# EAGLE design mlx90621_breakout (EAGLE 9.0.1)
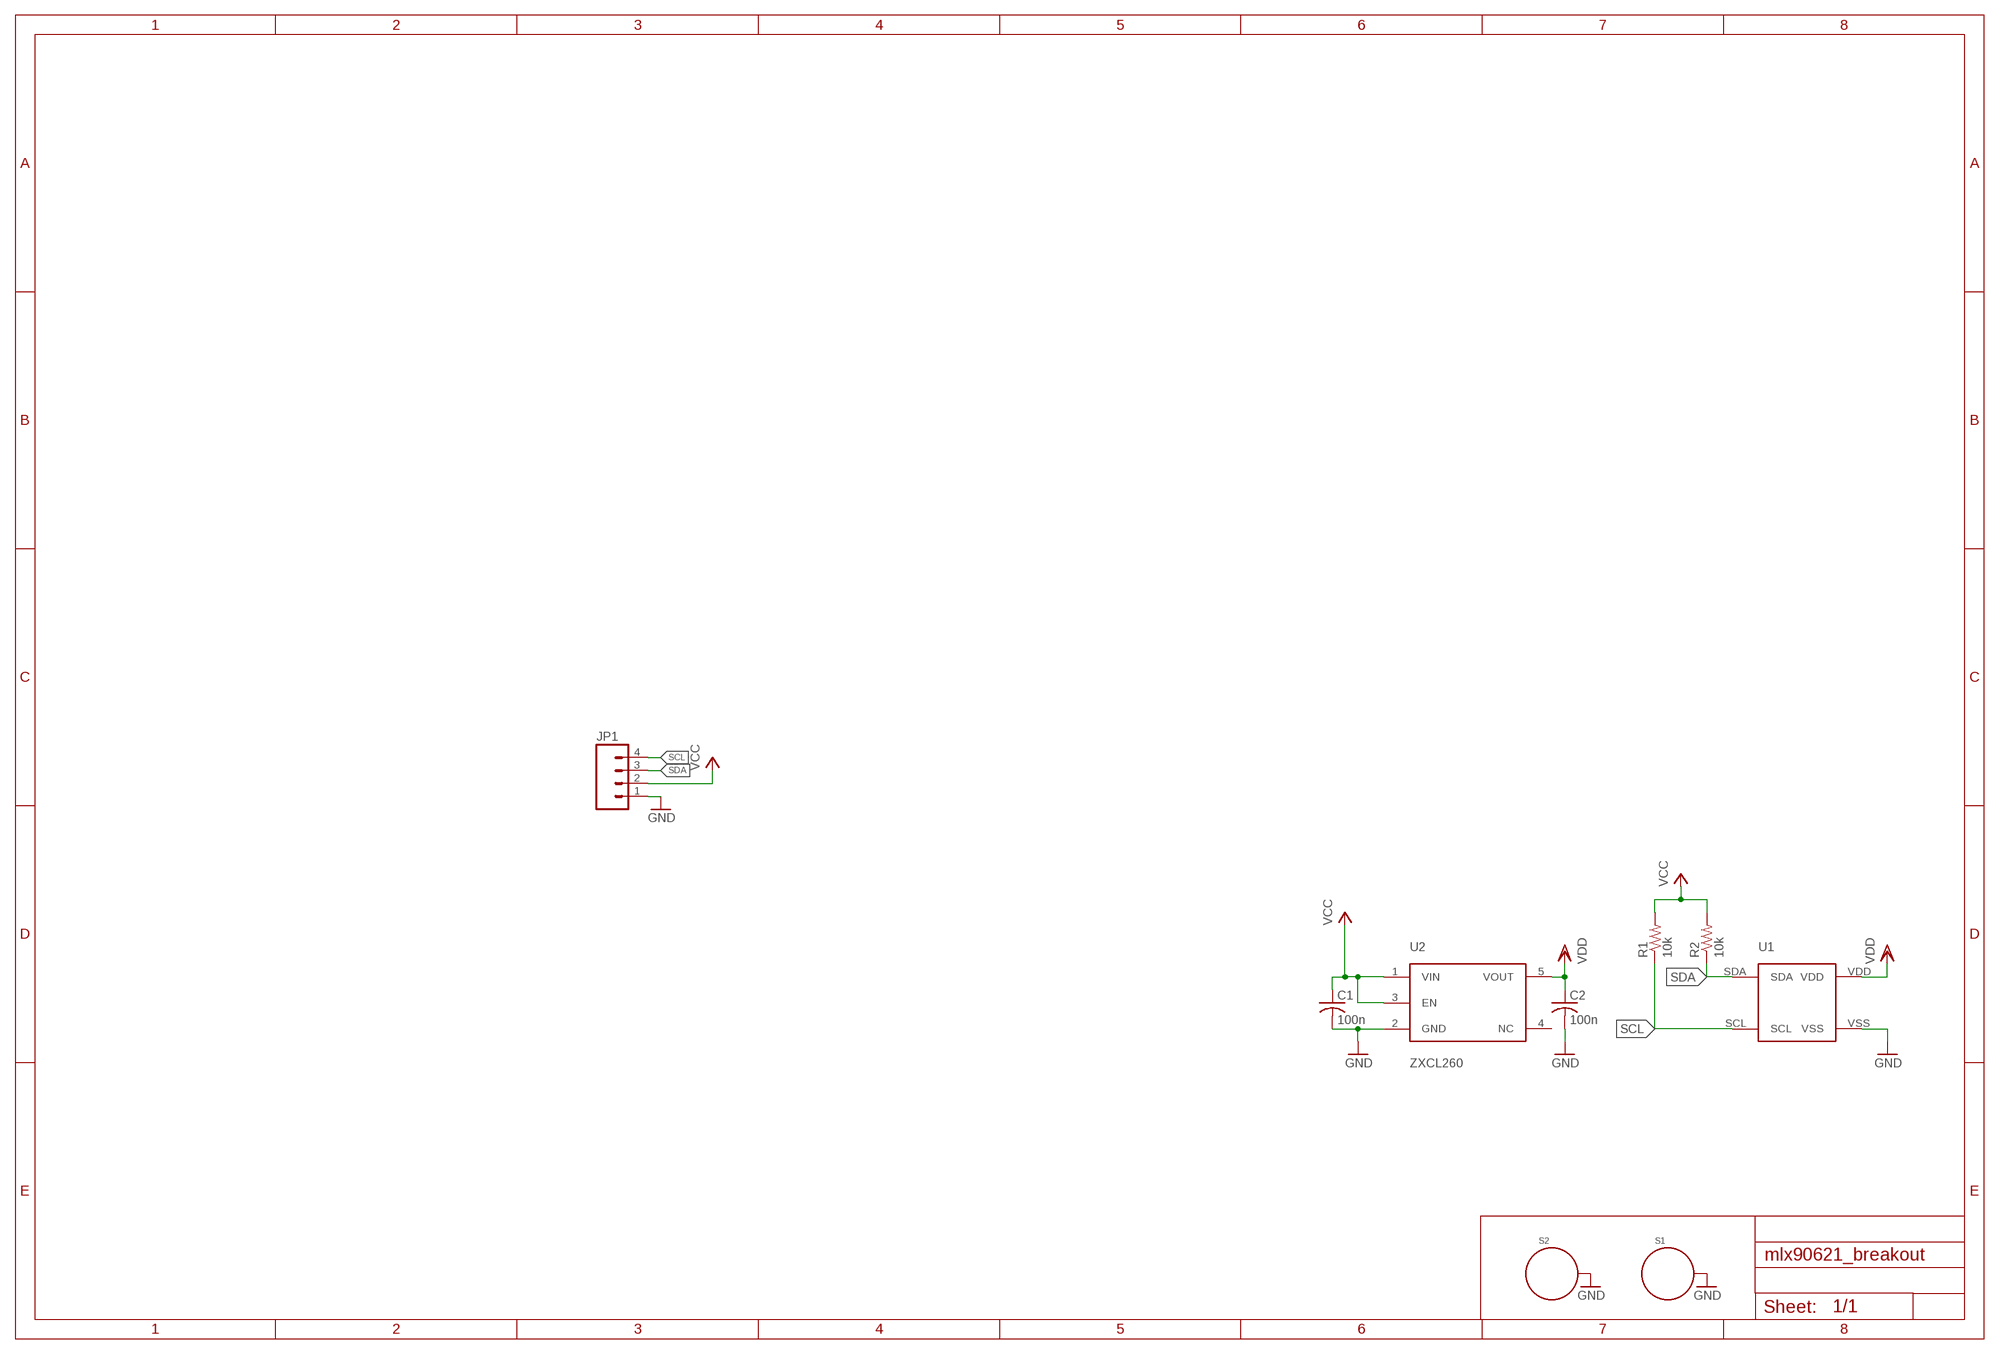
[diagram p0: schematic, sheet 1]

## Parts
C1  100n  C-USC0603  [C0603]
C2  100n  C-USC0603  [C0603]
JP1  M04PTH  [1X04]
R1  10k  R-US_R0603  [R0603]
R2  10k  R-US_R0603  [R0603]
S1  STANDOFF_ELECTRICAL  [STANDOFF-ELECTRICAL]
S2  STANDOFF_ELECTRICAL  [STANDOFF-ELECTRICAL]
U1  MLX90621BAD  [MLX90621]
U2  ZXCL260  [VREG_SOT23-5]

## Nets
GND: C1.2 C2.2 JP1.1 S1.P1 S2.P1 U1.VSS U2.2(GND)
SCL: JP1.4 R1.1 U1.SCL
SDA: JP1.3 R2.1 U1.SDA
VCC: C1.1 JP1.2 R1.2 R2.2 U2.1(VIN) U2.3(EN)
VDD: C2.1 U1.VDD U2.5(VOUT)
Unconnected: U2.4(NC)

## Library data of the parts
C1 C2 = adafruit:C-US: CAPACITOR, American symbol
JP1 = SparkFun-Connectors:M04: Header 4 Standard 4-pin 0.1" header. Use with straight break away headers (SKU : PRT-00116), right angle break away headers (PRT-00553), swiss pins (PRT-00743), machine pins (PRT-00117), and female headers (PRT-00115). Molex polarized connector foot print use with SKU : PRT-08231 with associated crimp pins and housings. 1MM SMD Version SKU: PRT-10208; PROD_ID: CONN-09696
R1 R2 = adafruit:R-US_: RESISTOR, American symbol
S1 S2 = SparkFun-Electromechanical:STANDOFF_ELECTRICAL: A standoff intended to be an electrically connected point. Pad size and stop size allow for a #4 Phillips pan screw head to make a solid connection to the board.
U1 = melexis:MLX90621
U2 = melexis:ZXCL260

## Board
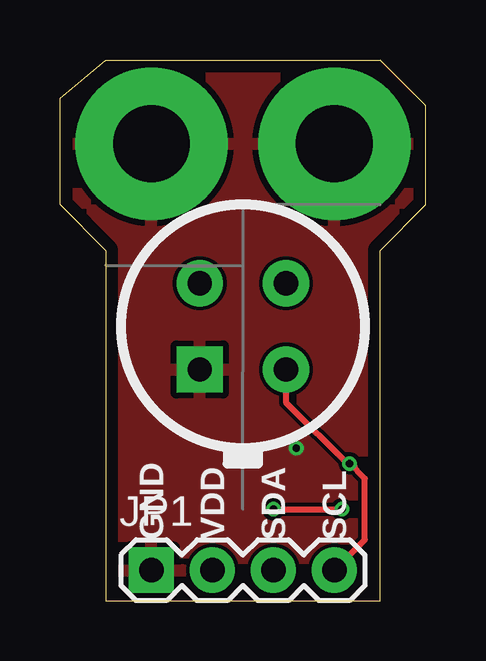
[diagram p1: board, top side]
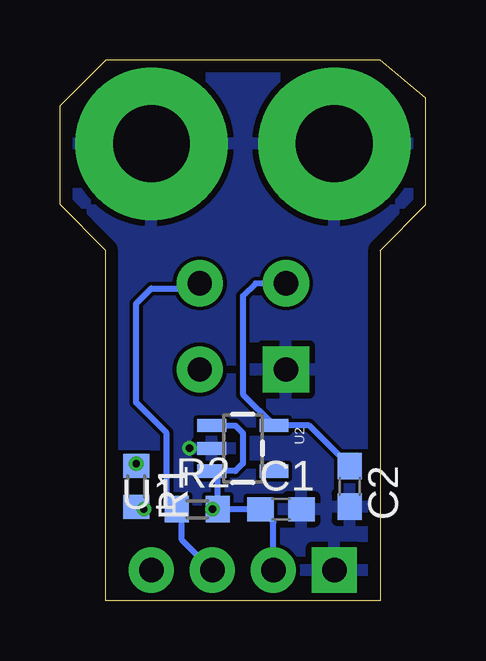
[diagram p2: board, bottom side, seen from below]

Size 15.24 x 22.54 mm. Coordinates in mm from the lower left corner, seen from the top.
Outline: 1.91,14.61 0,16.51 0,20.95 1.91,22.54 13.34,22.54 15.24,20.64 15.24,16.51 13.34,14.61 13.34,0 1.91,0 1.91,14.61
Copper layers (1*16): Top 0.035mm / dielectric 1.6mm / Bottom 0.035mm
Design rules "Elecrow_2-layer_PCB_eagle_rule": minimum track width 6mil, minimum drill 12mil, track to track 6mil, track to pad 6mil, pad to pad 6mil, via to via 8mil, smd to smd 0mil, copper to edge 20mil, drill to drill 10mil, minimum pad ring 6mil, minimum via ring 6mil, stop-mask expansion 0mil, vias tented up to drill 100mil, thermal gap 10mil

### Footprints (pad centres in the part's own frame; a part is rotated, then mirrored left to right if it is on the bottom)
C0603 = smd 1.1 x 1: 1 -0.85,0; 2 0.85,0
1X04 = drill 1.016 pad 1.88 square: 1 0,0 | drill 1.016 pad 1.88: 2 2.54,0; 3 5.08,0; 4 7.62,0
R0603 = smd 1 x 1.1: 1 -0.85,0; 2 0.85,0
STANDOFF-ELECTRICAL = drill 3.2 pad 6.35: P1 0,0
MLX90621 = drill 1.016 pad 1.93: SCL -1.796,-1.796; SDA -1.796,1.796; VDD 1.796,1.796 | drill 1.016 pad 1.93 square: VSS 1.796,-1.796
VREG_SOT23-5 = smd 0.55 x 1.2: 1 -0.95,-1.3; 2 0,-1.3; 3 0.95,-1.3; 4 0.95,1.3; 5 -0.95,1.3

### Placement (x,y rotation side)
C1  6.03,3.81 0 bottom
C2  3.17,4.76 270 bottom
JP1  3.81,1.27 0 top
R1  12.06,4.76 270 bottom
R2  9.53,3.81 0 bottom
S1  3.81,19.05 0 top
S2  11.43,19.05 0 top
U1  7.62,11.43 0 bottom
U2  7.62,6.35 270 bottom

### Tracks (layer width: path | path; a pad name or v marks a point on that pad's centre or on a via)
GND  (via drill 0.3)
  other vias: 9.84,6.35
  pour Top: -2.54,-2.54 -2.54,25.4 17.78,25.4 17.78,-2.54
  pour Bottom: -2.54,-2.54 -2.54,25.4 17.78,25.4 17.78,-2.54
SCL  (via drill 0.3)
  Top 0.254: JP1.4 12.7,2.54 12.7,5.08 v12.06,5.71 12.28,5.61 R1.1 9.42,8.26 U1.SCL
  Bottom 0.254: v12.06,5.71 12.28,5.71 R1.1
SDA
  Bottom 0.254: JP1.3 10.16,2.54 10.16,3.6 R2.1 10.48,3.81 10.79,4.13 10.79,6.99 12.06,8.26 12.06,12.38 11.43,13.02 9.62,13.02 U1.SDA
VCC  (via drill 0.3)
  Top 0.254: v8.89,3.81 v11.75,3.81
  Bottom 0.254: JP1.2 6.35,3.28 C1.1 R2.2 | R2.2 8.68,5.16 U2.3 7.94,5.4 7.62,5.71 7.62,6.99 7.93,7.3 U2.1 | R2.2 v8.89,3.81 | v11.75,3.81 R1.2
VDD
  Bottom 0.254: C2.1 4.86,7.3 U2.5 7.62,8.6 7.62,12.7 7.09,13.23 U1.VDD

### Text on the board
tPlace: GND | VDD | SDA | SCL